# EAGLE design Lia_Shield (EAGLE 6.4)
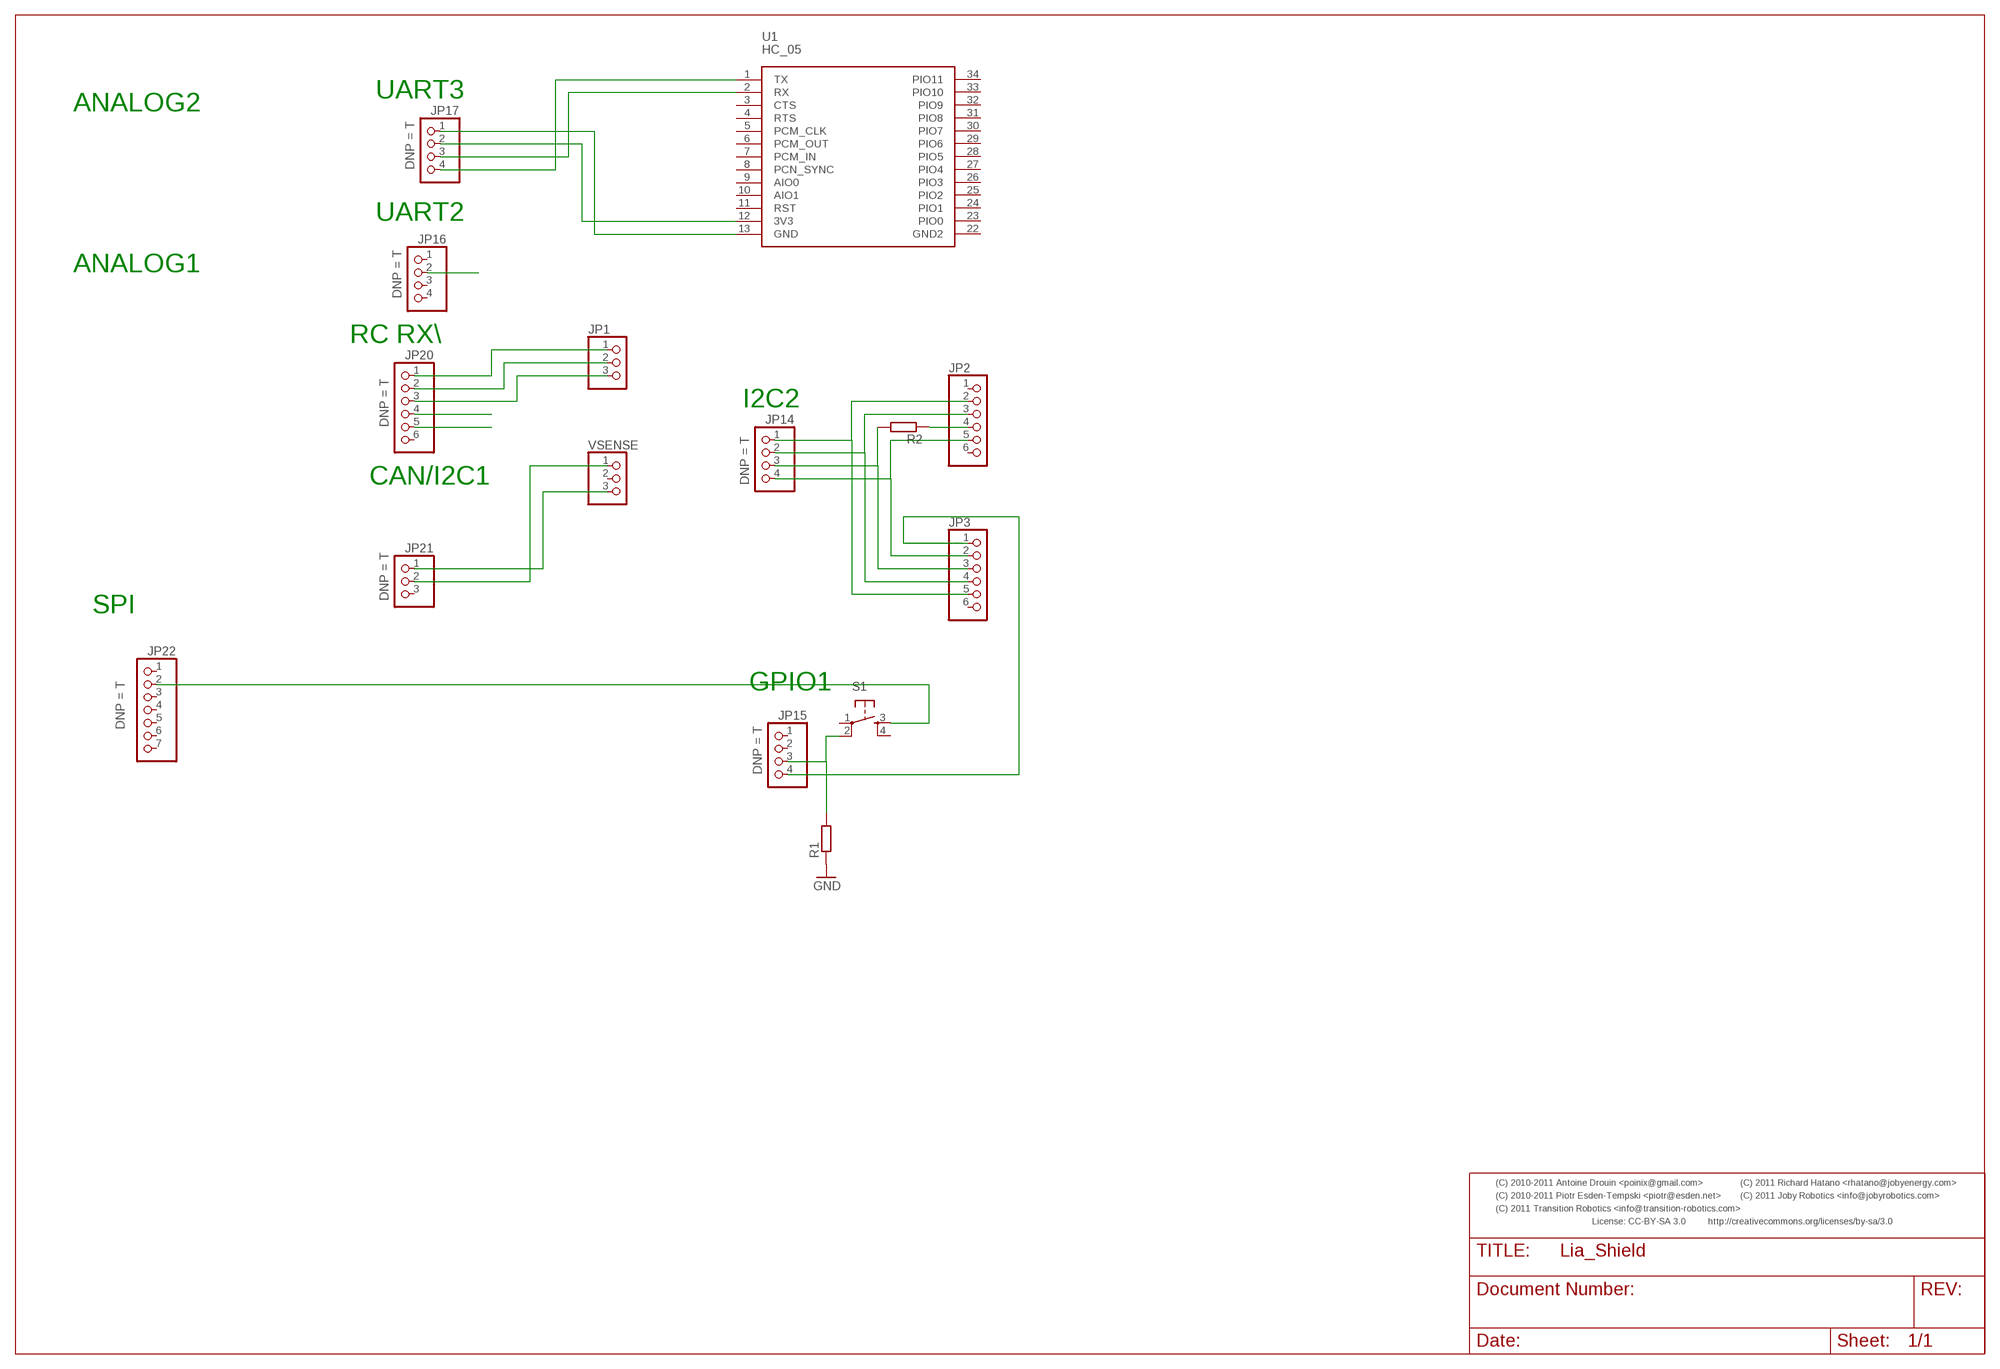
[diagram p0: schematic, sheet 1]

## Parts
JP1  PINHD-1X3/90  [1X03/90]
JP2  PINHD-1X6  [1X06]
JP3  PINHD-1X6  [1X06]
JP14  PINHD-1X4  [1X04]
JP15  PINHD-1X4  [1X04]
JP16  PINHD-1X4  [1X04]
JP17  PINHD-1X4  [1X04]
JP20  PINHD-1X6  [1X06]
JP21  PINHD-1X3  [1X03]
JP22  PINHD-1X7  [1X07]
R1  R-EU_R1206  [R1206]
R2  R-EU_R1206  [R1206]
S1  TAC_SWITCHPTH  [TACTILE-PTH]
U1  HC_05  [BLUETOOTH_SMD]
VSENSE  PINHD-1X3/90  [1X03/90]

## Nets
GND: JP1.1 JP20.1 JP20.4
N$1: JP21.2 VSENSE.1
N$2: JP1.3 JP20.3
N$8: JP17.3 U1.2(RX)
N$9: JP17.4 U1.1(TX)
N$10: JP3.3 JP14.3 R2.2
N$13: JP2.5 JP3.2 JP14.4
N$14: JP3.1 JP15.4
N$16: JP15.3 R1.2 S1.2
N$17: JP2.4 R2.1
RC1: JP2.2 JP3.5 JP14.1 JP17.1 JP21.1 R1.1 U1.13(GND) VSENSE.3 ; supply symbol labelled GND
VCC: JP1.2 JP2.3 JP3.4 JP14.2 JP16.2 JP17.2 JP20.2 JP20.5 JP22.2 S1.3 U1.12(3V3)
Unconnected: JP2.1 JP2.6 JP3.6 JP15.1 JP15.2 JP16.1 JP16.3 JP16.4 JP20.6 JP21.3 JP22.1 JP22.3 JP22.4 JP22.5 JP22.6 JP22.7 S1.1 S1.4 U1.3(CTS) U1.4(RTS) U1.5(PCM_CLK) U1.6(PCM_OUT) U1.7(PCM_IN) U1.8(PCN_SYNC) U1.9(AIO0) U1.10(AIO1) U1.11(RST) U1.22(GND2) U1.23(PIO0) U1.24(PIO1) U1.25(PIO2) U1.26(PIO3) U1.27(PIO4) U1.28(PIO5) U1.29(PIO6) U1.30(PIO7) U1.31(PIO8) U1.32(PIO9) U1.33(PIO10) U1.34(PIO11) VSENSE.2

## Notes on the sheet
- ANALOG2 | UART3
- UART2
- ANALOG1
- RC RX\
- I2C2
- CAN/I2C1
- SPI
- GPIO1
- (C) 2010-2011 Antoine Drouin <poinix@gmail.com> | (C) 2011 Richard Hatano <rhatano@jobyenergy.com>
- (C) 2010-2011 Piotr Esden-Tempski <piotr@esden.net> | (C) 2011 Joby Robotics <info@jobyrobotics.com>
- (C) 2011 Transition Robotics <info@transition-robotics.com>
- License: CC-BY-SA 3.0 | http://creativecommons.org/licenses/by-sa/3.0

## Library data of the parts
JP1 VSENSE = pinhead:PINHD-1X3: PIN HEADER
JP2 JP3 = pinhead:PINHD-1X6: PIN HEADER
JP14-JP17 = pinhead:PINHD-1X4: PIN HEADER; DNP: T; PARTNO: conn-th-0.1in-4-1
JP20 = pinhead:PINHD-1X6: PIN HEADER; DNP: T; PARTNO: conn-th-0.1in-6-1
JP21 = pinhead:PINHD-1X3: PIN HEADER; DNP: T; PARTNO: conn-th-0.1in-7-1
JP22 = pinhead:PINHD-1X7: PIN HEADER; DNP: T; PARTNO: conn-th-0.1in-7-1
R1 R2 = rcl:R-EU_: RESISTOR, European symbol
S1 = SparkFun-Electromechanical:TAC_SWITCH: Momentary Switch Button commonly used for reset or general input. Spark Fun Electronics SKU : COM-00097 SMT- SWCH-08247
U1 = Bluetooth HC-05:HC_05: HC-05 Bluetooth Module

## Net classes
0 default: width 0.152 mm, drill 0.305 mm, clearance 0.152 mm

## Board
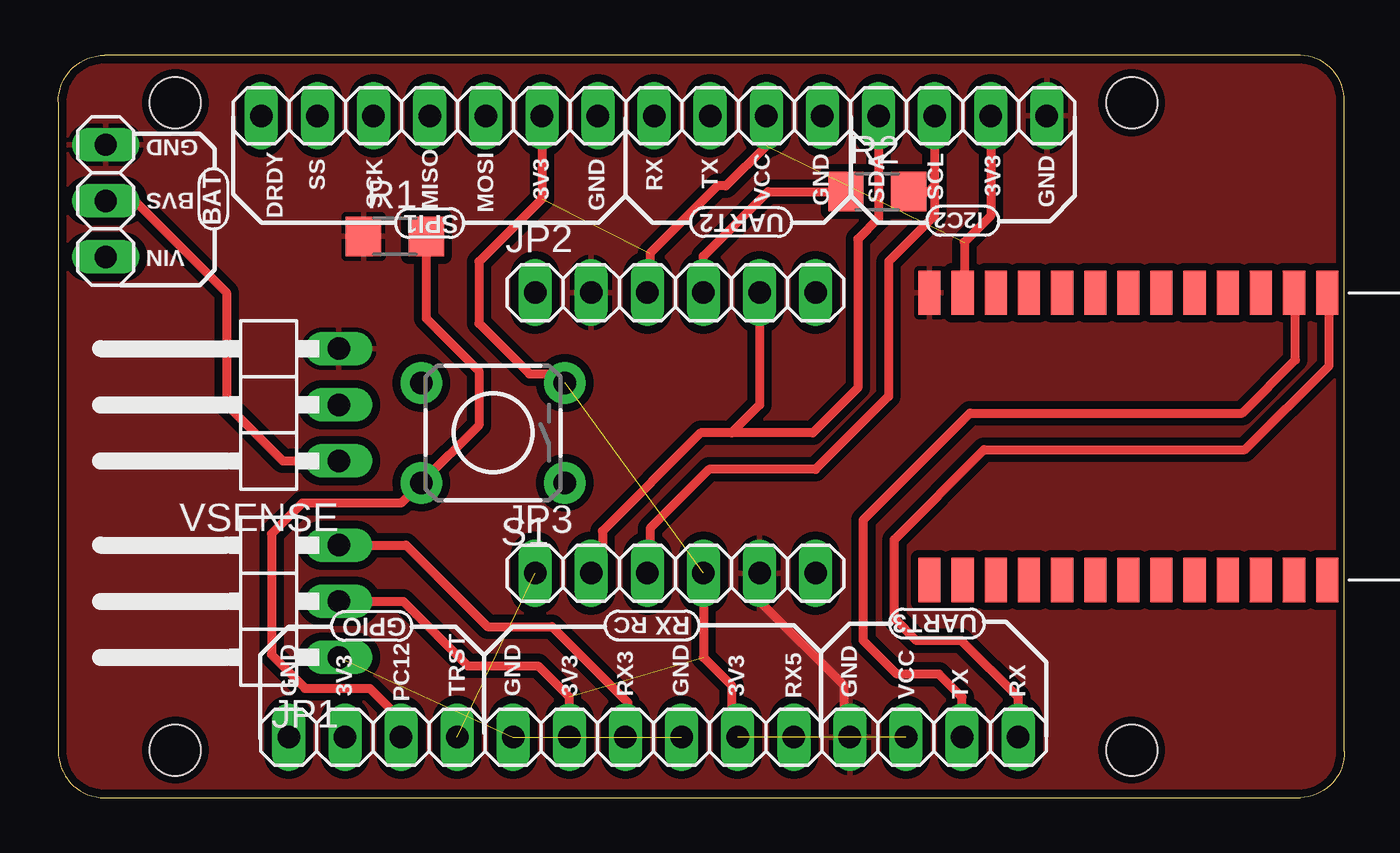
[diagram p1: board, top side]
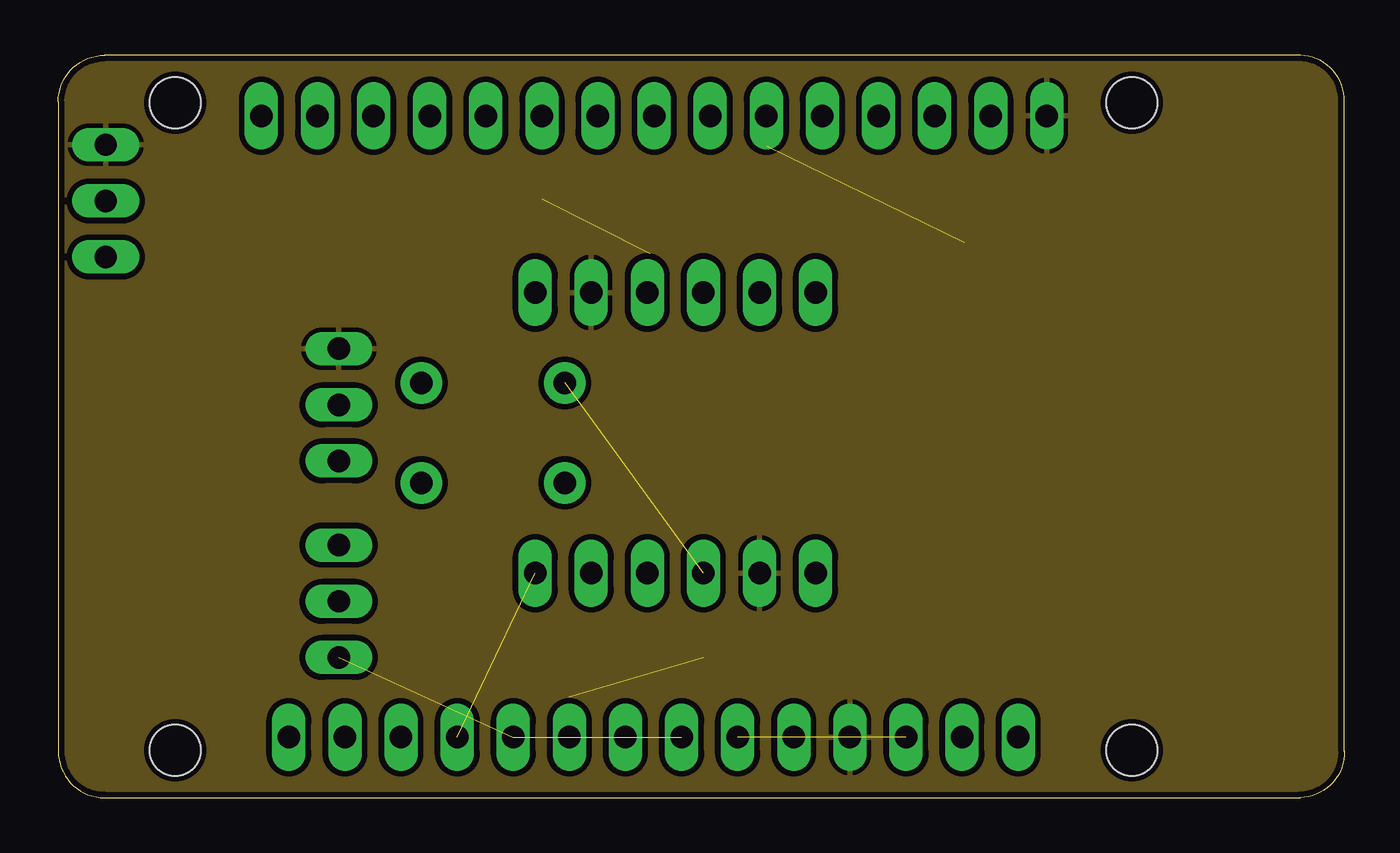
[diagram p2: board, inner layer Route2]
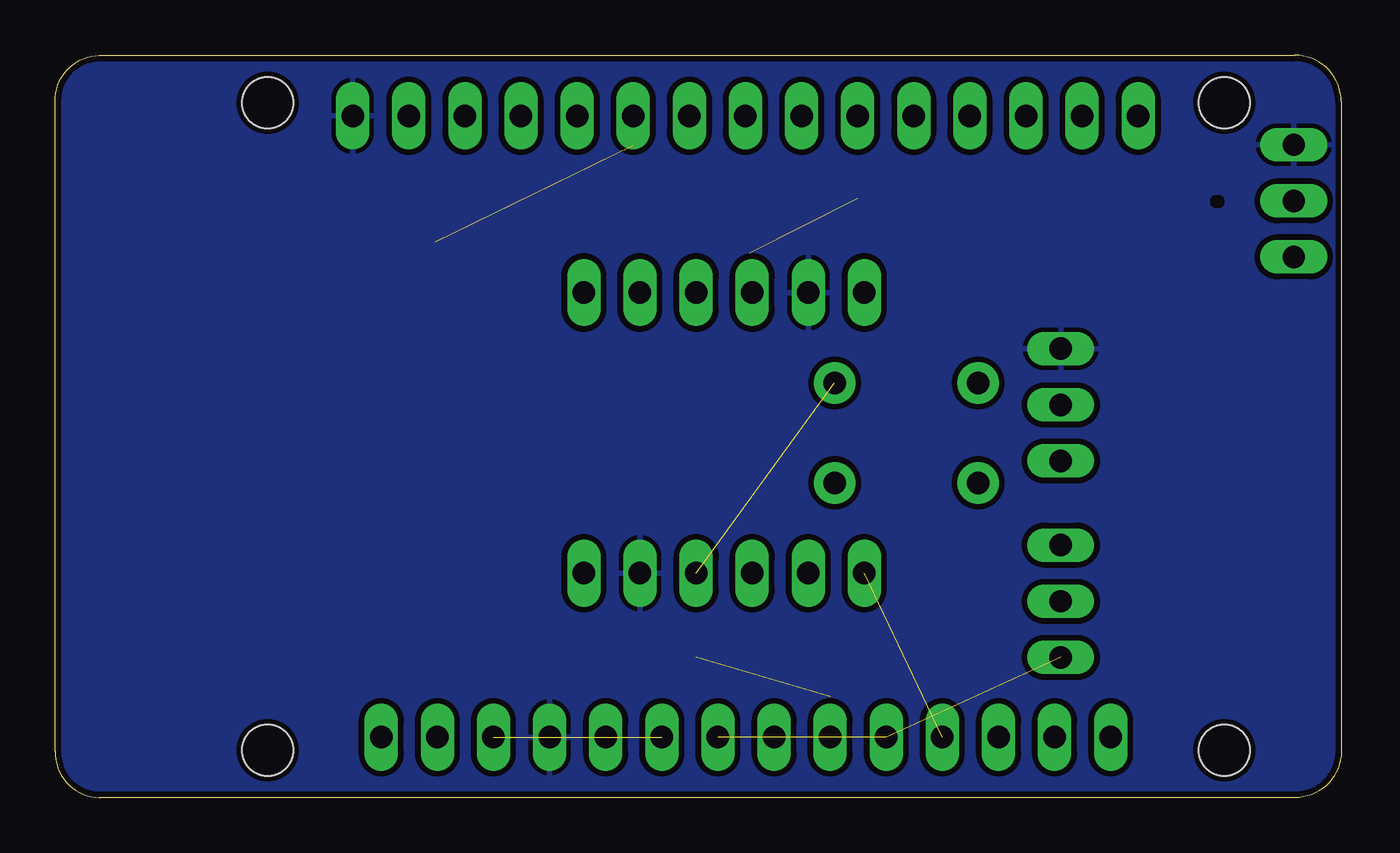
[diagram p3: board, bottom side, seen from below]

Size 58.22 x 33.6 mm. Coordinates in mm from the lower left corner, seen from the top.
Outline: 2.1,0 56.22,0 arc90 58.22,2.1 58.22,31.5 arc90 56.22,33.6 2.1,33.6 arc90 0,31.5 0,2.1 arc90 2.1,0
Copper layers (1*2+15*16): Top 0.035mm / dielectric 0.2mm / Route2 0.035mm / dielectric 1.5mm / Route15 0.035mm / dielectric 0.2mm / Bottom 0.035mm
Design rules "default *": minimum track width 0.15mm, minimum drill 10mil, track to track 8mil, track to pad 8mil, pad to pad 8mil, via to via 8mil, smd to smd 0.15mm, copper to edge 10mil, drill to drill 8mil, minimum pad ring 5mil, minimum via ring 5mil, stop-mask expansion 14mil, vias tented up to drill 0.31mm, thermal gap 8mil
Holes 2.3 mm at 5.3,2.15 5.3,31.45 48.6,31.45 48.6,2.15
tKeepout: area 3.3,0.1 to 7.3,4.2; area 46.6,0.1 to 50.6,4.2; area 3.3,29.4 to 7.3,33.5; area 46.6,29.4 to 50.6,33.5
bRestrict: area 5.5,26.9 to 5.7,27

### Footprints (pad centres in the part's own frame; a part is rotated, then mirrored left to right if it is on the bottom)
1X03/90 = drill 1.016 long: 1 -2.54,-3.81; 2 0,-3.81; 3 2.54,-3.81
1X06 = drill 1.016 long: 1 -6.35,0; 2 -3.81,0; 3 -1.27,0; 4 1.27,0; 5 3.81,0; 6 6.35,0
1X04 = drill 1.016 long: 1 -3.81,0; 2 -1.27,0; 3 1.27,0; 4 3.81,0
1X03 = drill 1.016 long: 1 -2.54,0; 2 0,0; 3 2.54,0
1X07 = drill 1.016 long: 1 -7.62,0; 2 -5.08,0; 3 -2.54,0; 4 0,0; 5 2.54,0; 6 5.08,0; 7 7.62,0
R1206 = smd 1.6 x 1.803: 1 -1.422,0; 2 1.422,0
TACTILE-PTH = drill 1.016 pad 1.88: 1 -3.251,2.261; 2 3.251,2.261; 3 -3.251,-2.261; 4 3.251,-2.261
BLUETOOTH_SMD = smd 2 x 1: 1 -6.35,3.81; 2 -6.35,2.31; 3 -6.35,0.81; 4 -6.35,-0.69; 5 -6.35,-2.19; 6 -6.35,-3.69; 7 -6.35,-5.19; 8 -6.35,-6.69; 9 -6.35,-8.19; 10 -6.35,-9.69; 11 -6.35,-11.19; 12 -6.35,-12.69; 13 -6.35,-14.19; 22 6.65,-14.19; 23 6.65,-12.69; 24 6.65,-11.19; 25 6.65,-9.69; 26 6.65,-8.19; 27 6.65,-6.69; 28 6.65,-5.19; 29 6.65,-3.69; 30 6.65,-2.19; 31 6.65,-0.69; 32 6.65,0.81; 33 6.65,2.31; 34 6.65,3.81

### Placement (x,y rotation side)
JP1  8.89,8.89 90 top
JP2  27.94,22.86 0 top
JP3  27.94,10.16 0 top
JP14  40.94,30.86 180 top
JP15  14.25,2.74 0 top
JP16  30.78,30.86 180 top
JP17  39.65,2.74 0 top
JP20  26.95,2.74 0 top
JP21  2.15,27.01 270 top
JP22  16.81,30.86 180 top
R1  15.24,25.4 0 top
R2  37.08,27.43 0 top
S1  19.68,16.51 180 top
U1  53.63,16.5 270 top
VSENSE  8.89,17.78 90 top

### Tracks (layer width: path | path; a pad name or v marks a point on that pad's centre or on a via)
GND  (2 unrouted)
N$1
  Top 0.406: JP21.2 3.47,27.01 7.62,22.86 7.62,17.78 10.16,15.24 VSENSE.1
N$2
  Top 0.406: JP1.3 15.75,11.43 19.43,7.75 22.35,7.75 25.78,4.32 25.78,2.84 JP20.3
N$8
  Top 0.406: JP17.3 40.92,4.55 39.88,5.59 37.97,5.59 36.45,7.11 36.45,12.57 41.27,17.4 53.59,17.4 56.01,19.81 56.01,22.79 U1.2
N$9
  Top 0.406: JP17.4 43.46,4.55 40.89,7.11 38.86,7.11 37.85,8.13 37.85,11.68 41.91,15.75 53.72,15.75 57.53,19.56 57.53,22.76 U1.1
N$10
  Top 0.406: JP14.3 39.67,27.69 | 39.67,27.69 39.67,26.34 37.59,24.26 37.59,18.16 34.29,14.86 29.46,14.86 26.8,12.19 26.8,10.29 JP3.3 | R2.2 39.42,27.43 39.67,27.69
N$13
  Top 0.406: JP14.4 37.13,26.21 36.2,25.27 36.2,18.54 34.16,16.51 30.48,16.51 | 30.48,16.51 29.08,16.51 24.64,12.06 24.64,10.67 JP3.2 | JP2.5 31.75,17.78 30.48,16.51
N$14  (1 unrouted)
N$16
  Top 0.406: JP15.3 15.49,2.77 15.49,3.56 14.1,4.95 11.18,4.95 9.65,6.48 9.65,11.94 11.05,13.34 15.52,13.34 S1.2 19.05,16.87 19.05,19.3 16.66,21.69 R1.2
N$17
  Top 0.406: JP2.4 29.21,24.51 32.13,27.43 R2.1
RC1
  Top 0.406: JP3.5 31.75,8.89 35.56,5.08 35.56,3.02 JP17.1
  pour Route2 (isolate 0.254): 0,0 0,33.6 58.22,33.6 58.22,0
  pour Bottom (isolate 0.254, rank 2): 0,0 0,33.6 58.22,33.6 58.22,0
  pour Top (isolate 0.356, rank 2): 0,33.6 58.22,33.6 58.22,0 0,0
VCC  (5 unrouted)
  Top 0.406: JP22.2 21.89,27.1 19.05,24.26 19.05,21.46 21.34,19.18 22.53,19.18 S1.3 | JP14.2 42.21,26.34 41.02,25.15 41.02,22.93 U1.12 | JP16.2 32.05,29.51 30.23,27.69 29.84,27.69 26.8,24.64 26.8,22.99 JP2.3 | JP3.4 29.21,6.35 30.48,5.08 30.48,3.02 JP20.5 | JP1.2 15.62,8.89 18.54,5.97 21.72,5.97 23.11,4.57 23.11,2.77 JP20.2

### Text on the board
tPlace: GND | DRDY | SS | SCK | MISO | MOSI | 3V3 | GND | RX | TX | VCC | GND | SDA | SCL | 3V3 | GND | BAT | BVS | SPI1 | UART2 | I2C2 | VIN | RC | RX | UART3 | GPIO | GND | 3V3 | TRST | GND | 3V3 | RX3 | GND | 3V3 | RX5 | GND | RX | PC12 | VCC | TX